# Altium schematic sheet Buzzer.schdoc
size 292 x 193 mm; Opracowal: Martyna Stankiewicz; projRevision: MM; Author: Martyna Stankiewicz; CompanyName: Politechnika Warszawska; Organization: EITI; Address1: Nowowiejska 15/19; Address2: 00-665 Warszawa; Revision: MM; SheetNumber: 7; SheetTotal: 8; HTTPLink: www.pw.edu.pl
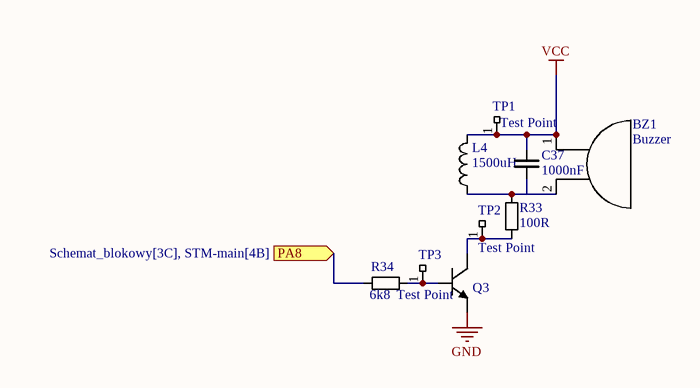
[diagram p0: Buzzer.schdoc]

## Parts
BZ1  Buzzer  [XDCR_PS1240P02BT]
C37  1000nF  [0603_CAP]
L4  1500uH  [IND_LQH43MN152K03L]
Q3  NPN  [SOT95P240X110-3N]  (value not drawn)
R33  100R  [0603_RES]
R34  6k8  [0603_RES]
TP1  Test Point  [pad]  (no BOM)
TP2  Test Point  [pad]  (no BOM)
TP3  Test Point  [pad]  (no BOM)

## Ports
PA8 (in, see Schemat_blokowy[3C], STM-main[4B])

## Nets
GND: Q3.2(E)
VCC: BZ1.1 C37.2 L4.2 TP1.1
PA8: R34.1 ; port PA8
NetBZ1_2: BZ1.2 C37.1 L4.1 R33.2
NetQ3_1: Q3.1(B) R34.2 TP3.1
NetQ3_3: Q3.3(C) R33.1 TP2.1

## Notes on the sheet
- Data:
- Tytuł:
- Rev.:
- Rozm.:
- A4
- Strona:
- z
- PBL4
- Opracował:

## Library data of the parts
BZ1 = Buzzer: PartNumber: PS1240P02BT
C37 = Cap: Ceramic capacitor; Value: 1000nF
L4 = Inductor: PartNumber: LQH43MN152J03L; Value: 1500uH; Link: https://www.digikey.pl/en/products/detail/murata-electronics/LQH43MN152J03L/2594506?_gl=1*1qj429k*_up*MQ..*_gs*MQ..&gclid=Cj0KCQjwqcO_BhDaARIsACz62vPoBc739cp1REhPwRacIq9Hmi_6DHVVJt4UIt_29A6Hw2SO46MFMW8aApgZEALw_wcB&gclsrc=aw.ds
Q3 = NPN: NPN General-purpose Transistor; PartNumber: BC848C-7-F; Link: https://www.digikey.pl/en/products/detail/diodes-incorporated/BC848C-7-F/1934460?s=N4IgTCBcDaIEIGEAcAWJCC0B2DAxEAugL5A
R33 R34 = RES: Resistor
  R33: Value: 100R
  R34: Value: 6k8